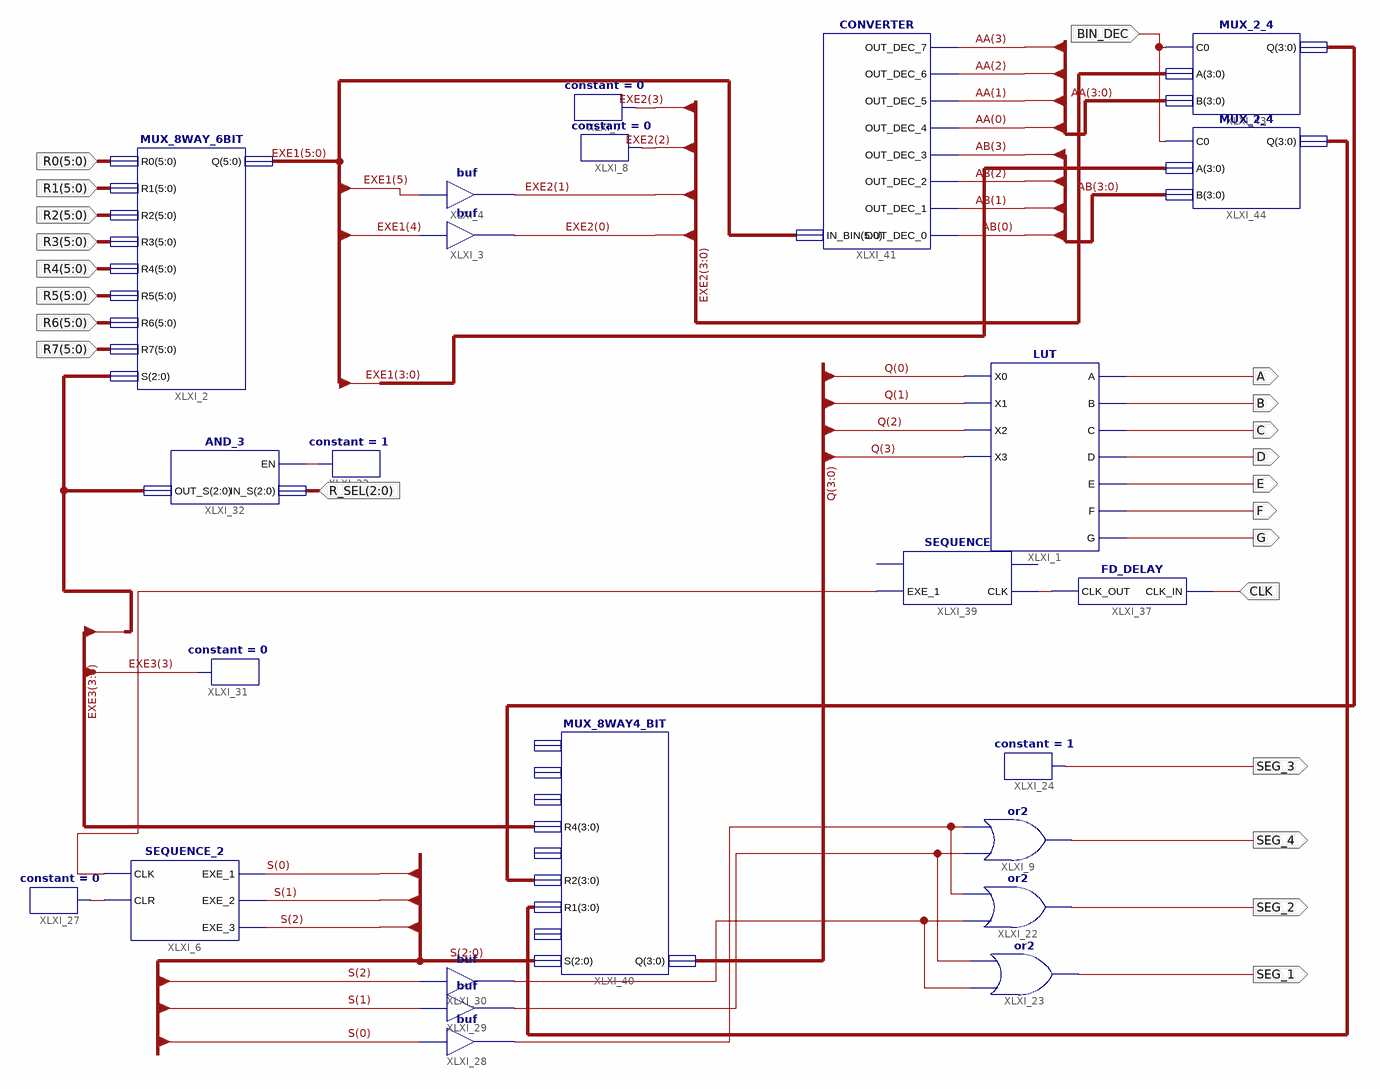
[diagram p0: schematic sheet 1]
// Xilinx ISE schematic SEVEN_SEG_NEW.sch (spartan3e) as structural Verilog: 24 symbols, 22 ports
module SEVEN_SEG_NEW (
  input  [5:0] R0,
  input  [5:0] R1,
  input  [5:0] R2,
  input  [5:0] R3,
  input  [5:0] R4,
  input  [5:0] R5,
  input  [5:0] R6,
  input  [5:0] R7,
  input  [2:0] R_SEL,
  input  CLK,
  input  BIN_DEC,
  output SEG_4,
  output SEG_2,
  output SEG_1,
  output SEG_3,
  output A,
  output B,
  output C,
  output D,
  output E,
  output F,
  output G
);

  wire XLXN_78, XLXN_82, XLXN_85, XLXN_90, XLXN_105, XLXN_109, XLXN_110;
  wire [2:0] S;
  wire [3:0] AA, AB, EXE2, EXE3, Q, XLXN_130, XLXN_131;
  wire [5:0] EXE1;

  MUX_8WAY_6BIT XLXI_2 (
    .Q(EXE1), .R0(R0), .R1(R1), .R2(R2), .R3(R3), .R4(R4), .R5(R5), .R6(R6), .R7(R7), .S(EXE3[2:0]));
  buf XLXI_3 (EXE2[0], EXE1[4]);
  buf XLXI_4 (EXE2[1], EXE1[5]);
  SEQUENCE_2 XLXI_6 (.CLK(XLXN_110), .CLR(XLXN_78), .EXE_1(S[0]), .EXE_2(S[1]), .EXE_3(S[2]));
  constant #(.CValue("0")) XLXI_7 (.O(EXE2[3]));
  constant #(.CValue("0")) XLXI_8 (.O(EXE2[2]));
  or XLXI_9 (SEG_4, XLXN_85, XLXN_82);
  or XLXI_22 (SEG_2, XLXN_90, XLXN_82);
  or XLXI_23 (SEG_1, XLXN_90, XLXN_85);
  constant #(.CValue("1")) XLXI_24 (.O(SEG_3));
  constant #(.CValue("0")) XLXI_27 (.O(XLXN_78));
  buf XLXI_29 (XLXN_85, S[1]);
  constant #(.CValue("0")) XLXI_31 (.O(EXE3[3]));
  AND_3 XLXI_32 (.EN(XLXN_105), .IN_S(R_SEL), .OUT_S(EXE3[2:0]));
  FD_DELAY XLXI_37 (.CLK_IN(CLK), .CLK_OUT(XLXN_109));
  SEQUENCE XLXI_39 (.CLK(XLXN_109), .EXE_1(XLXN_110));  // open: CLR, EXE_2
  constant #(.CValue("1")) XLXI_33 (.O(XLXN_105));
  buf XLXI_28 (XLXN_82, S[0]);
  buf XLXI_30 (XLXN_90, S[2]);
  MUX_8WAY4_BIT XLXI_40 (.Q(Q), .R1(XLXN_131), .R2(XLXN_130), .R4(EXE3), .S(S));  // open: R0, R3, R5, R6, R7
  CONVERTER XLXI_41 (
    .IN_BIN(EXE1), .OUT_DEC_0(AB[0]), .OUT_DEC_1(AB[1]), .OUT_DEC_2(AB[2]), .OUT_DEC_3(AB[3]),
    .OUT_DEC_4(AA[0]), .OUT_DEC_5(AA[1]), .OUT_DEC_6(AA[2]), .OUT_DEC_7(AA[3]));
  LUT XLXI_1 (.A(A), .B(B), .C(C), .D(D), .E(E), .F(F), .G(G), .X0(Q[0]), .X1(Q[1]), .X2(Q[2]), .X3(Q[3]));
  MUX_2_4 XLXI_43 (.A(EXE2), .B(AA), .C0(BIN_DEC), .Q(XLXN_130));
  MUX_2_4 XLXI_44 (.A(EXE1[3:0]), .B(AB), .C0(BIN_DEC), .Q(XLXN_131));
endmodule
